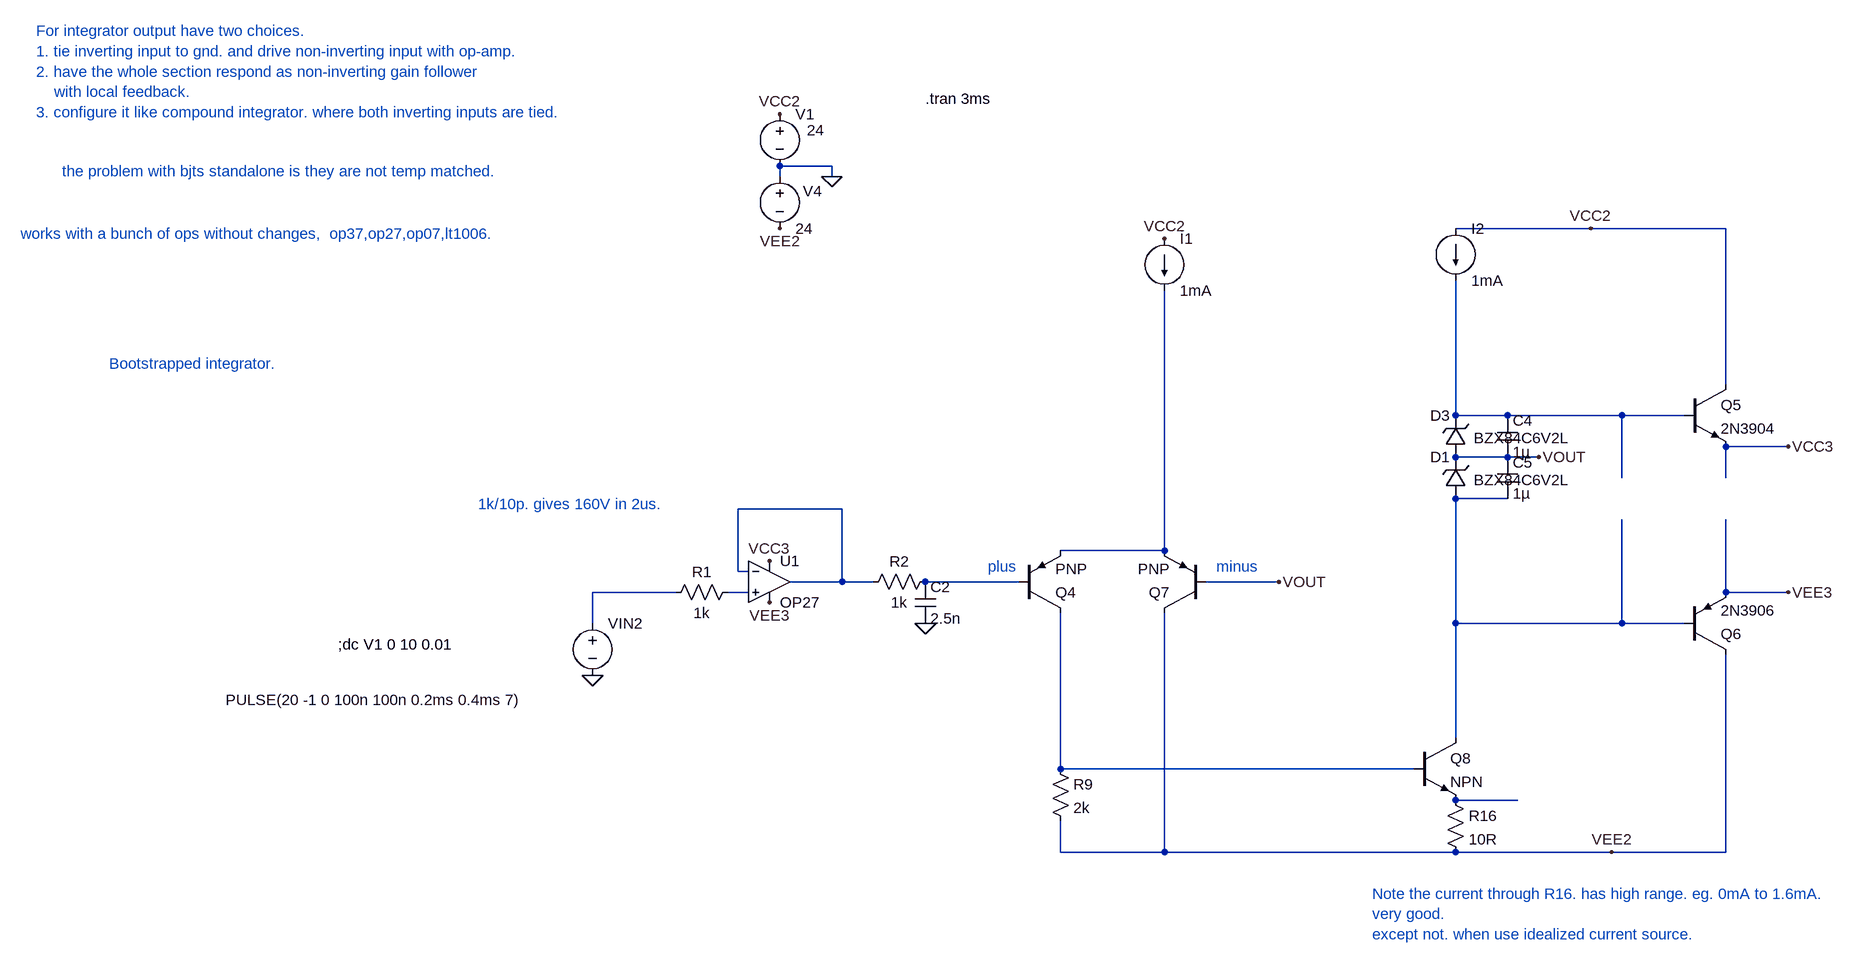
[diagram p0: schematic Draft47.asc]
Draft47.asc, the LTspice schematic file:
Version 4
SHEET 1 1508 952
WIRE -256 -288 -336 -288
WIRE -336 -272 -336 -288
WIRE -256 -272 -256 -288
WIRE 912 -192 704 -192
WIRE 1120 -192 912 -192
WIRE 1120 48 1120 -192
WIRE 704 96 704 -112
WIRE 784 96 704 96
WIRE 960 96 784 96
WIRE 1056 96 960 96
WIRE 1216 144 1120 144
WIRE 784 160 704 160
WIRE 832 160 784 160
WIRE 960 192 960 96
WIRE 1120 192 1120 144
WIRE 784 224 704 224
WIRE -240 240 -400 240
WIRE 256 304 256 -96
WIRE 256 304 96 304
WIRE -400 336 -400 240
WIRE -384 336 -400 336
WIRE -240 352 -240 240
WIRE -240 352 -320 352
WIRE -192 352 -240 352
WIRE 32 352 -112 352
WIRE 432 352 320 352
WIRE -496 368 -624 368
WIRE -384 368 -416 368
WIRE 1120 368 1120 256
WIRE 1216 368 1120 368
WIRE -624 416 -624 368
WIRE 704 416 704 224
WIRE 960 416 960 256
WIRE 960 416 704 416
WIRE 1056 416 960 416
WIRE 704 592 704 416
WIRE 96 640 96 400
WIRE 640 640 96 640
WIRE 800 688 704 688
WIRE 96 768 96 720
WIRE 256 768 256 400
WIRE 256 768 96 768
WIRE 704 768 256 768
WIRE 944 768 704 768
WIRE 1120 768 1120 464
WIRE 1120 768 944 768
FLAG -256 -272 0
FLAG -336 -368 VCC2
FLAG -336 -192 VEE2
FLAG 912 -192 VCC2
FLAG 944 768 VEE2
FLAG 832 160 VOUT
FLAG 256 -176 VCC2
FLAG -624 496 0
FLAG 432 352 VOUT
FLAG 1216 144 VCC3
FLAG 1216 368 VEE3
FLAG -352 320 VCC3
FLAG -352 384 VEE3
FLAG -112 416 0
SYMBOL voltage -336 -384 R0
WINDOW 123 0 0 Left 0
WINDOW 39 0 0 Left 0
WINDOW 3 42 41 Left 2
SYMATTR Value 24
SYMATTR InstName V1
SYMBOL voltage -336 -288 R0
WINDOW 123 0 0 Left 0
WINDOW 39 0 0 Left 0
WINDOW 0 36 39 Left 2
SYMATTR InstName V4
SYMATTR Value 24
SYMBOL npn 1056 48 R0
SYMATTR InstName Q5
SYMATTR Value 2N3904
SYMBOL pnp 1056 464 M180
SYMATTR InstName Q6
SYMATTR Value 2N3906
SYMBOL res 80 624 R0
SYMATTR InstName R9
SYMATTR Value 2k
SYMBOL res 688 672 R0
SYMATTR InstName R16
SYMATTR Value 10R
SYMBOL pnp 32 400 M180
SYMATTR InstName Q4
SYMBOL pnp 320 400 R180
SYMATTR InstName Q7
SYMBOL npn 640 592 R0
SYMATTR InstName Q8
SYMBOL current 256 -176 R0
WINDOW 123 0 0 Left 0
WINDOW 39 0 0 Left 0
SYMATTR InstName I1
SYMATTR Value 1mA
SYMBOL current 704 -192 R0
WINDOW 123 0 0 Left 0
WINDOW 39 0 0 Left 0
SYMATTR InstName I2
SYMATTR Value 1mA
SYMBOL voltage -624 400 R0
WINDOW 123 0 0 Left 0
WINDOW 39 0 0 Left 0
WINDOW 3 -565 134 Left 2
SYMATTR Value PULSE(20 -1 0 100n 100n 0.2ms 0.4ms 7)
SYMATTR InstName VIN2
SYMBOL res -400 352 R90
WINDOW 0 0 56 VBottom 2
WINDOW 3 32 56 VTop 2
SYMATTR InstName R1
SYMATTR Value 1k
SYMBOL res -96 336 R90
WINDOW 0 0 56 VBottom 2
WINDOW 3 32 56 VTop 2
SYMATTR InstName R2
SYMATTR Value 1k
SYMBOL zener 720 160 R180
WINDOW 0 24 64 Left 2
WINDOW 3 -159 29 Left 2
SYMATTR InstName D3
SYMATTR Value BZX84C6V2L
SYMBOL zener 720 224 R180
WINDOW 0 24 64 Left 2
WINDOW 3 -159 29 Left 2
SYMATTR InstName D1
SYMATTR Value BZX84C6V2L
SYMBOL cap -128 352 R0
SYMATTR InstName C2
SYMATTR Value 2.5n
SYMBOL OpAmps\\OP27 -352 288 R0
SYMATTR InstName U1
SYMBOL cap 768 96 R0
SYMATTR InstName C4
SYMATTR Value 1µ
SYMBOL cap 768 160 R0
SYMATTR InstName C5
SYMATTR Value 1µ
TEXT -112 -392 Left 2 !.tran 3ms
TEXT 336 328 Left 2 ;minus
TEXT -1440 -280 Left 2 ;the problem with bjts standalone is they are not temp matched.
TEXT 576 832 Left 2 ;Note the current through R16. has high range. eg. 0mA to 1.6mA.\nvery good.\nexcept not. when use idealized current source.
TEXT -1480 -496 Left 2 ;For integrator output have two choices.\n1. tie inverting input to gnd. and drive non-inverting input with op-amp.\n2. have the whole section respond as non-inverting gain follower\n    with local feedback.\n3. configure it like compound integrator. where both inverting inputs are tied.
TEXT -1016 448 Left 2 !;dc V1 0 10 0.01
TEXT -1368 16 Left 2 ;Bootstrapped integrator.
TEXT -800 232 Left 2 ;1k/10p. gives 160V in 2us.
TEXT -16 328 Left 2 ;plus
TEXT -1504 -184 Left 2 ;works with a bunch of ops without changes,  op37,op27,op07,lt1006.

The netlist it stands for:
* Draft47.asc
V1 VCC2 0 24
V4 0 VEE2 24
Q5 VCC2 N001 VCC3 0 2N3904
Q6 VEE2 N002 VEE3 0 2N3906
R9 N008 VEE2 2k
R16 N009 VEE2 10R
Q4 N008 N005 N004 0 PNP
Q7 VEE2 VOUT N004 0 PNP
Q8 N002 N008 N009 0 NPN
I1 VCC2 N004 1mA
I2 VCC2 N001 1mA
VIN2 N006 0 PULSE(20 -1 0 100n 100n 0.2ms 0.4ms 7)
R1 N007 N006 1k
R2 N005 N003 1k
D3 VOUT N001 BZX84C6V2L
D1 N002 VOUT BZX84C6V2L
C2 N005 0 2.5n
XU1 N007 N003 VCC3 VEE3 N003 OP27  ; pins In+ In- V+ V- OUT
C4 N001 VOUT 1µ
C5 VOUT N002 1µ
.model D D
.lib standard.dio
.model NPN NPN
.model PNP PNP
.lib standard.bjt
.tran 3ms
* minus
* the problem with bjts standalone is they are not temp matched.
* Note the current through R16. has high range. eg. 0mA to 1.6mA.
* very good.
* except not. when use idealized current source.
* For integrator output have two choices.
* 1. tie inverting input to gnd. and drive non-inverting input with op-amp.
* 2. have the whole section respond as non-inverting gain follower
*     with local feedback.
* 3. configure it like compound integrator. where both inverting inputs are tied.
;dc V1 0 10 0.01
* Bootstrapped integrator.
* 1k/10p. gives 160V in 2us.
* plus
* works with a bunch of ops without changes,  op37,op27,op07,lt1006.
.lib ADI.lib
.backanno
.end